# Altium schematic sheet ESP32 With USBC.SchDoc
size A2; SheetNumber: 1; SheetTotal: 1
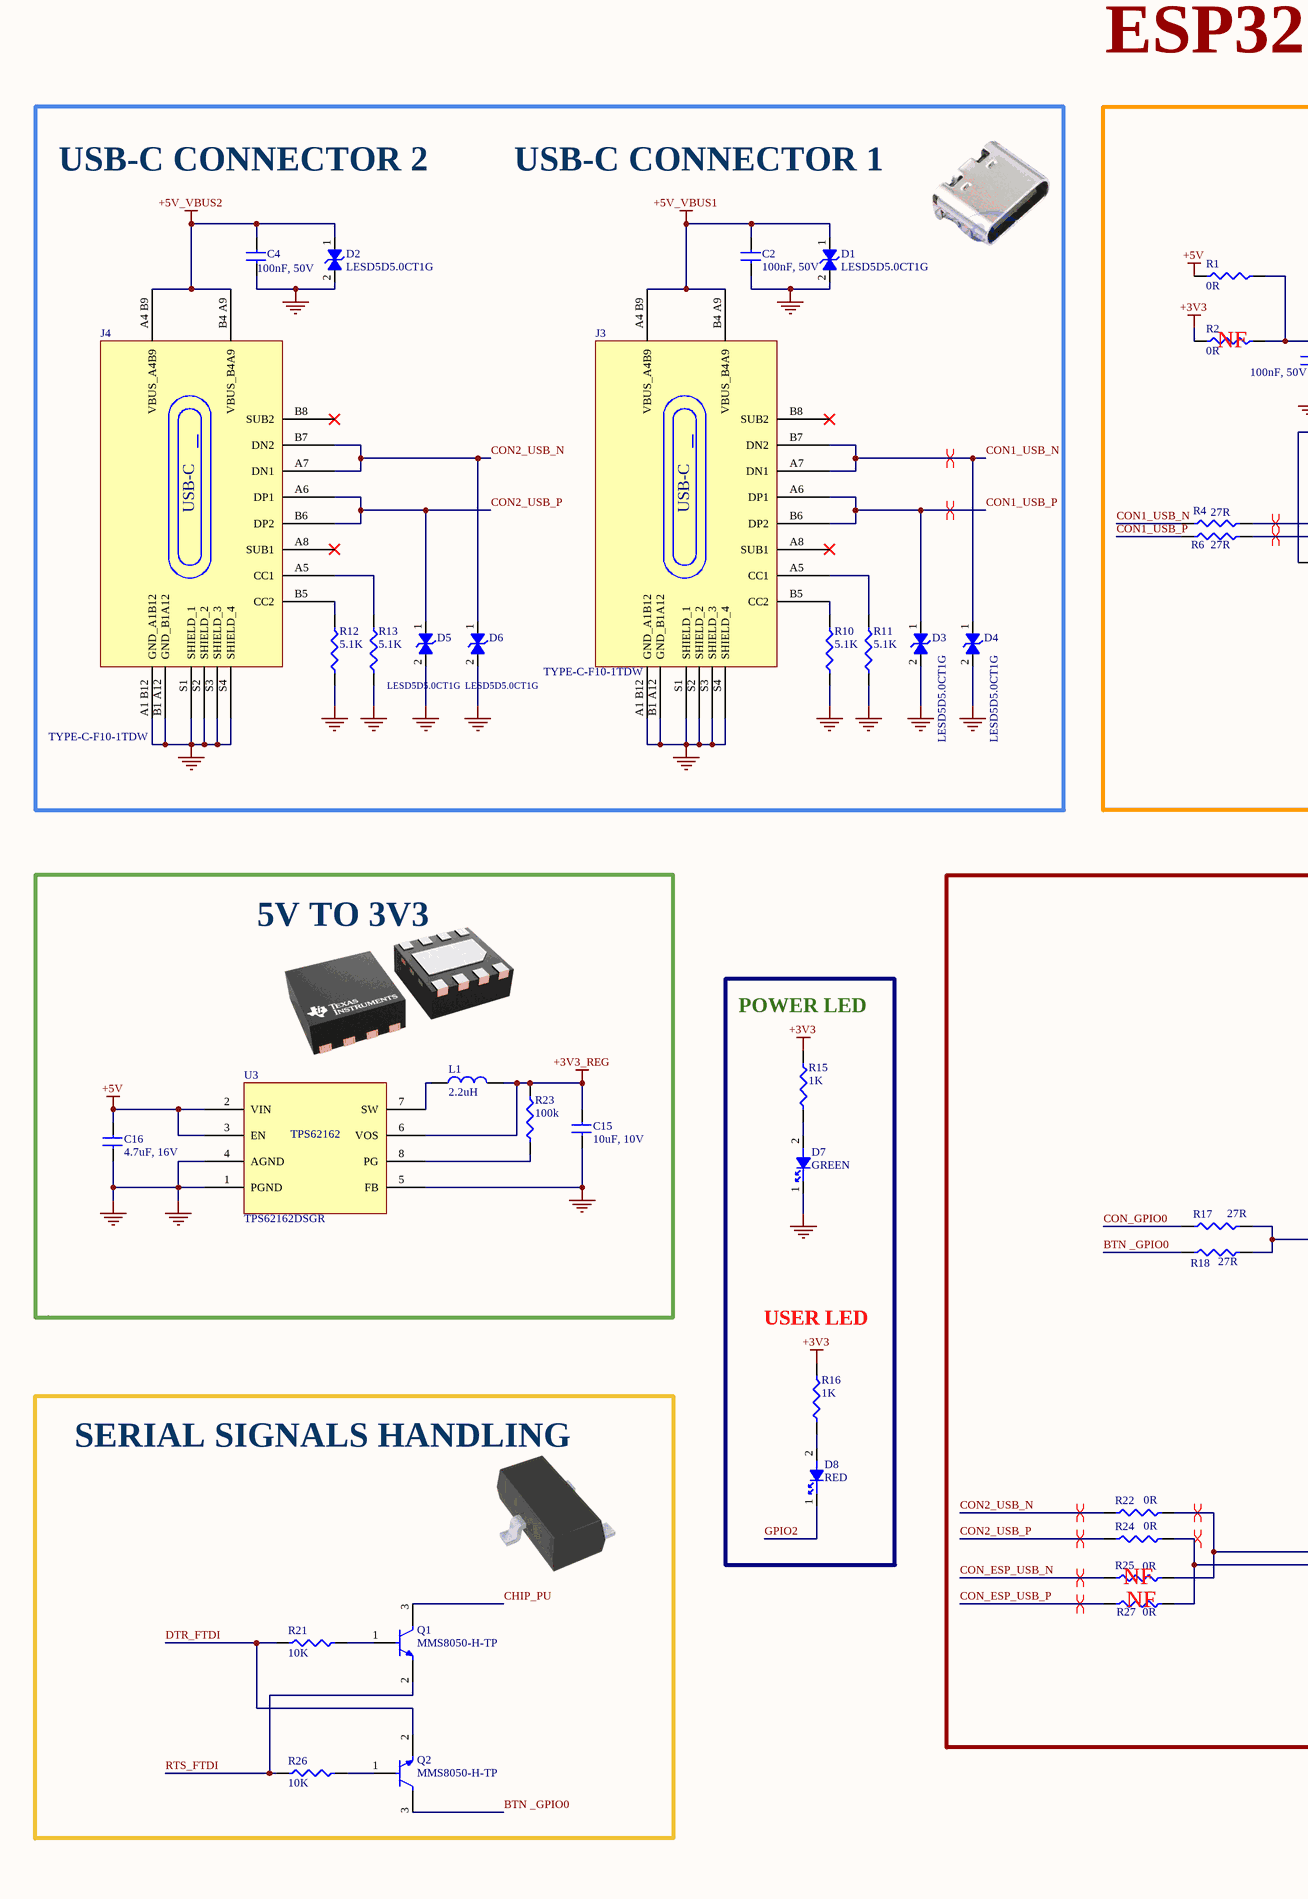
[diagram p0: ESP32 With USBC.SchDoc, left]
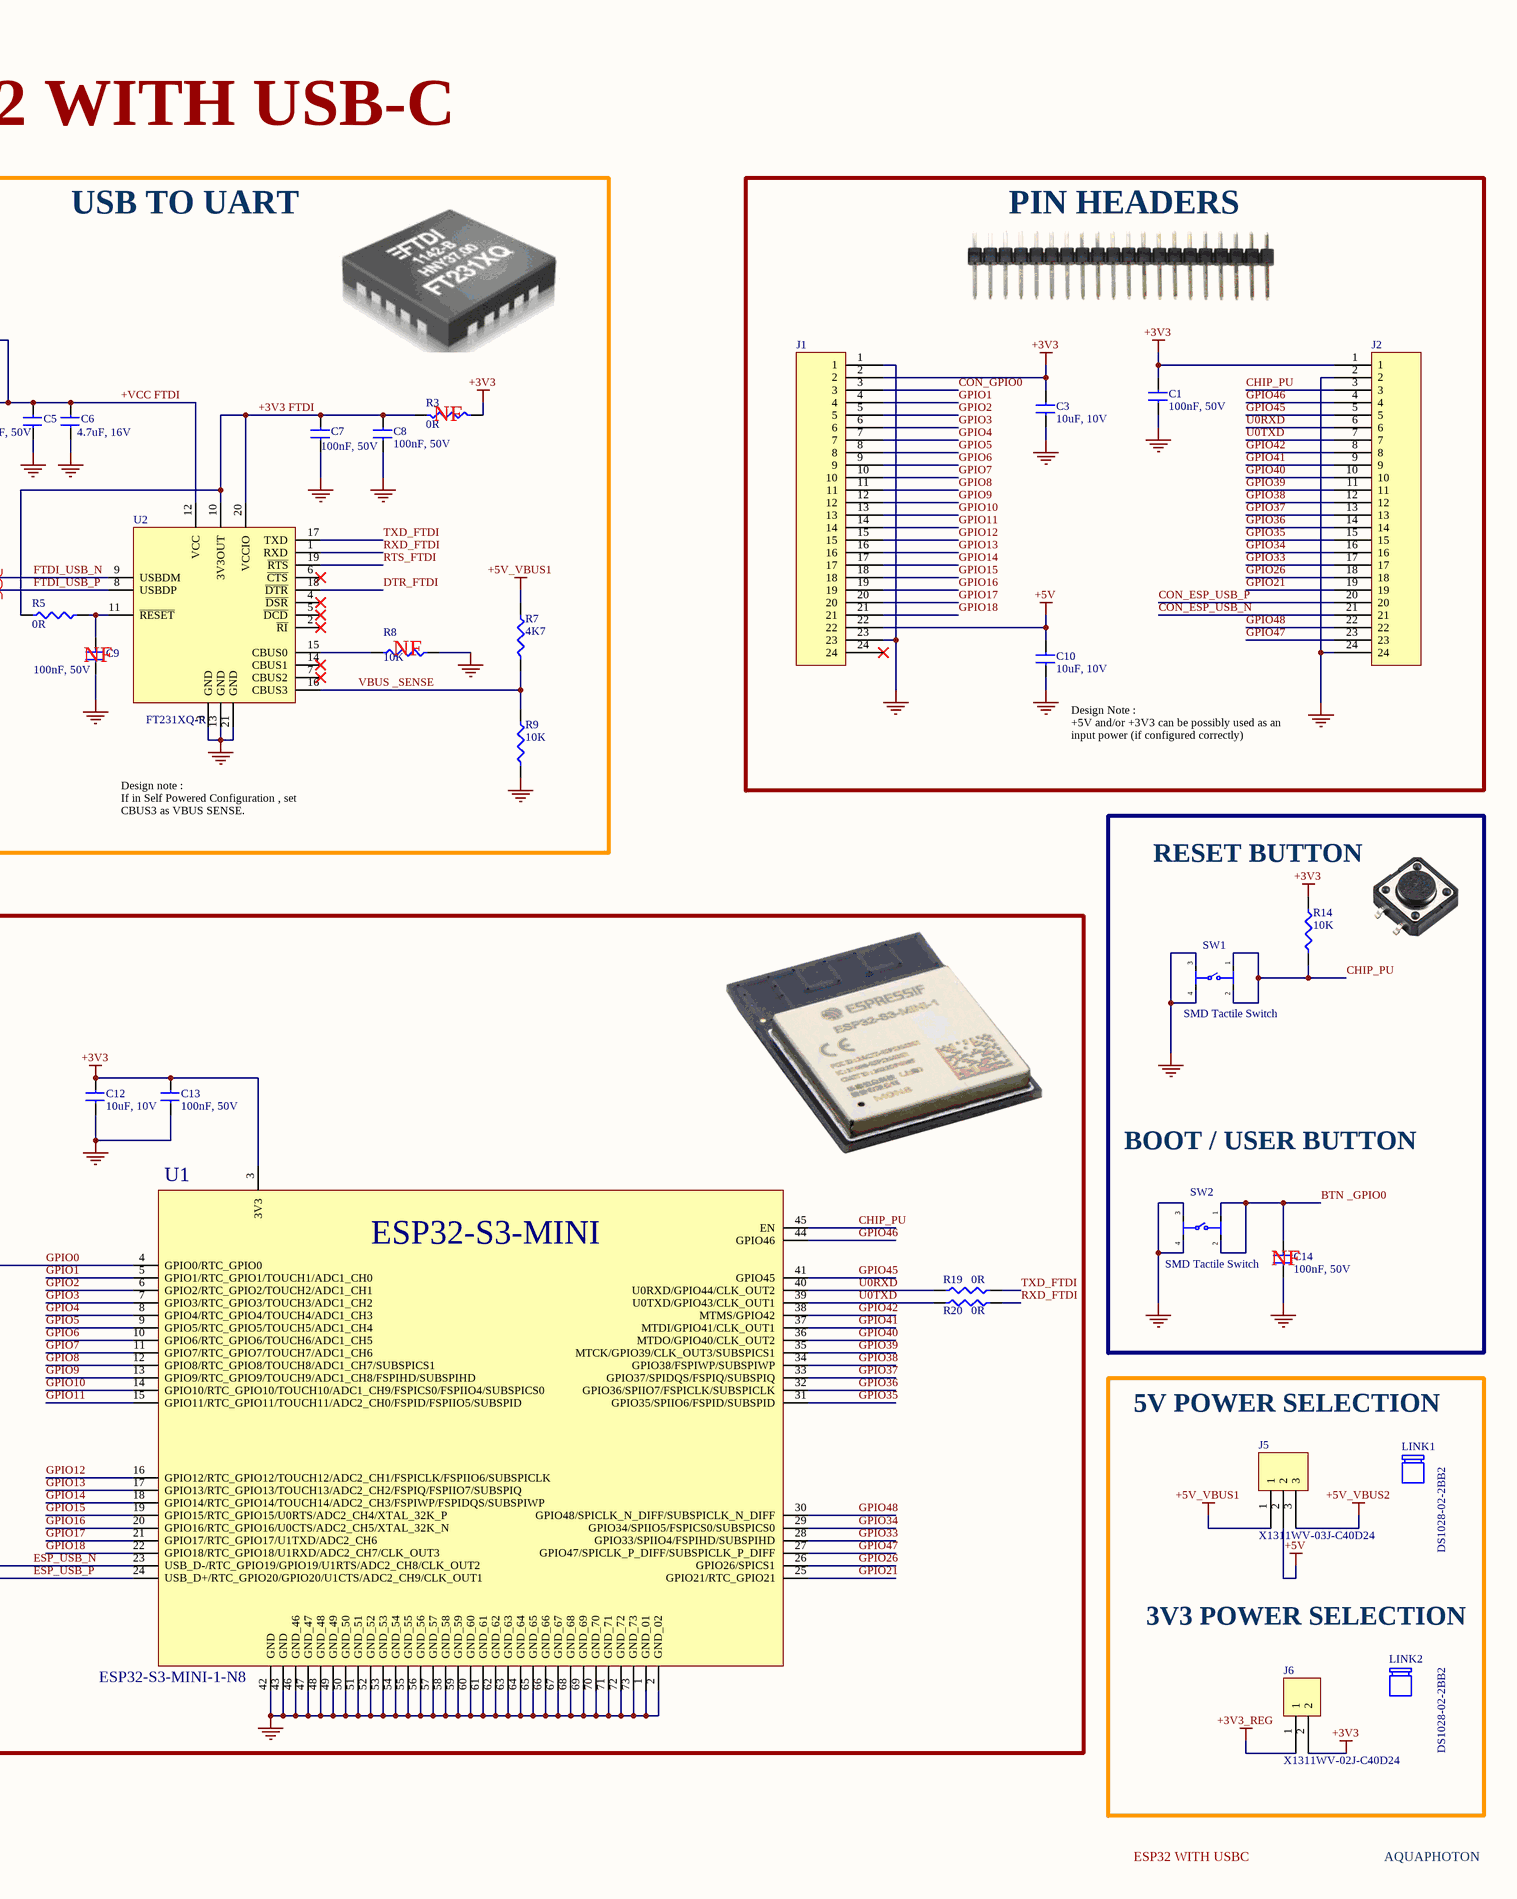
[diagram p1: ESP32 With USBC.SchDoc, right]

## Parts
C1  100nF, 50V  [CAP_SMD_0402_Samsung]
C2  100nF, 50V  [CAP_SMD_0402_Samsung]
C3  10uF, 10V  [CAP_SMD_0402_Samsung]
C4  100nF, 50V  [CAP_SMD_0402_Samsung]
C5  100nF, 50V  [CAP_SMD_0402_Samsung]
C6  4.7uF, 16V  [CAP_SMD_0402_Samsung]
C7  100nF, 50V  [CAP_SMD_0402_Samsung]
C8  100nF, 50V  [CAP_SMD_0402_Samsung]
C9  100nF, 50V  [CAP_SMD_0402_Samsung]
C10  10uF, 10V  [CAP_SMD_0402_Samsung]
C12  10uF, 10V  [CAP_SMD_0402_Samsung]
C13  100nF, 50V  [CAP_SMD_0402_Samsung]
C14  100nF, 50V  [CAP_SMD_0402_Samsung]
C15  10uF, 10V  [CAP_SMD_0402_Samsung]
C16  4.7uF, 16V  [CAP_SMD_0402_Samsung]
D1  LESD5D5.0CT1G  [TVS-Diode]
D2  LESD5D5.0CT1G  [TVS-Diode]
D3  LESD5D5.0CT1G  [TVS-Diode]
D4  LESD5D5.0CT1G  [TVS-Diode]
D5  LESD5D5.0CT1G  [TVS-Diode]
D6  LESD5D5.0CT1G  [TVS-Diode]
D7  GREEN  [LED_0402_G]
D8  RED  [LED_0402_R]
J1  X5511WV-24-C35D35-1000  [HDR_1X24_2.54MM]  (value not drawn)
J2  X5511WV-24-C35D35-1000  [HDR_1X24_2.54MM]  (value not drawn)
J3  TYPE-C-F10-1TDW  [USB-C]
J4  TYPE-C-F10-1TDW  [USB-C]
J5  X1311WV-03J-C40D24  [HDR_1X3_1.27mm - duplicate]
J6  X1311WV-02J-C40D24  [HDR_1X2_1.27mm]
L1  2.2uH  [Inductor_SMD_2.2uH]
LINK1  DS1028-02-2BB2  (mechanical)
LINK2  DS1028-02-2BB2  (mechanical)
Q1  MMS8050-H-TP  [SOT_Transistor]
Q2  MMS8050-H-TP  [SOT_Transistor]
R1  0R  [RES_SMD_0402]
R2  0R  [RES_SMD_0402]
R3  0R  [RES_SMD_0402]
R4  27R  [RES_SMD_0402]
R5  0R  [RES_SMD_0402]
R6  27R  [RES_SMD_0402]
R7  4K7  [RES_SMD_0402]
R8  10K  [RES_SMD_0402]
R9  10K  [RES_SMD_0402]
R10  5.1K  [RES_SMD_0402]
R11  5.1K  [RES_SMD_0402]
R12  5.1K  [RES_SMD_0402]
R13  5.1K  [RES_SMD_0402]
R14  10K  [RES_SMD_0402]
R15  1K  [RES_SMD_0402]
R16  1K  [RES_SMD_0402]
R17  27R  [RES_SMD_0402]
R18  27R  [RES_SMD_0402]
R19  0R  [RES_SMD_0402]
R20  0R  [RES_SMD_0402]
R21  10K  [RES_SMD_0402]
R22  0R  [RES_SMD_0402]
R23  100k  [RES_SMD_0402]
R24  0R  [RES_SMD_0402]
R25  0R  [RES_SMD_0402]
R26  10K  [RES_SMD_0402]
R27  0R  [RES_SMD_0402]
SW1  SMD Tactile Switch  [Tactile Switch_SMD]
SW2  SMD Tactile Switch  [Tactile Switch_SMD]
U1  ESP32-S3-MINI-1-N8  [ESP32-S3-MINI-1-N8]
U2  FT231XQ-R  [USB TO UART _FTDI]
U3  TPS62162DSGR  [BUCK_TPS62162DSGR]

## Nets
+3V3: C1.2 C3.2 C12.2 C13.2 J1.2 J2.1 J6.2 R2.1 R3.1 R14.2 R15.2 R16.2 U1.3(3V3)
+3V3_REG: C15.2 J6.1 L1.2 R23.2 U3.6(VOS)
+5V: C10.2 C16.2 J1.22 J5.2 R1.1 U3.2(VIN) U3.3(EN)
+5V_VBUS1: C2.2 D1.1 J3.A4_B9(VBUS_A4B9) J3.B4_A9(VBUS_B4A9) J5.1 R7.2
+5V_VBUS2: C4.2 D2.1 J4.A4_B9(VBUS_A4B9) J4.B4_A9(VBUS_B4A9) J5.3
GND: C1.1 C2.1 C3.1 C4.1 C5.1 C6.1 C7.1 C8.1 C9.1 C10.1 C12.1 C13.1 C14.1 C15.1 C16.1 D1.2 D2.2 D3.2 D4.2 D5.2 D6.2 D7.1 J1.1 J1.23 J2.2 J2.24 J3.A1_B12(GND_A1B12) J3.B1_A12(GND_B1A12) J3.S1(SHIELD_1) J3.S2(SHIELD_2) J3.S3(SHIELD_3) J3.S4(SHIELD_4) J4.A1_B12(GND_A1B12) J4.B1_A12(GND_B1A12) J4.S1(SHIELD_1) J4.S2(SHIELD_2) J4.S3(SHIELD_3) J4.S4(SHIELD_4) R8.2 R9.1 R10.1 R11.1 R12.1 R13.1 SW1.3 SW1.4 SW2.3 SW2.4 U1.1(GND_01) U1.2(GND_02) U1.42(GND) U1.43(GND) U1.46(GND_46) U1.47(GND_47) U1.48(GND_48) U1.49(GND_49) U1.50(GND_50) U1.51(GND_51) U1.52(GND_52) U1.53(GND_53) U1.54(GND_54) U1.55(GND_55) U1.56(GND_56) U1.57(GND_57) U1.58(GND_58) U1.59(GND_59) U1.60(GND_60) U1.61(GND_61) U1.62(GND_62) U1.63(GND_63) U1.64(GND_64) U1.65(GND_65) U1.66(GND_66) U1.67(GND_67) U1.68(GND_68) U1.69(GND_69) U1.70(GND_70) U1.71(GND_71) U1.72(GND_72) U1.73(GND_73) U2.3(GND) U2.13(GND) U2.21(GND) U3.1(PGND) U3.4(AGND) U3.5(FB)
+3V3 FTDI: C7.2 C8.2 R3.2 R5.1 U2.10(3V3OUT) U2.20(VCCIO)
+VCC FTDI: C5.2 C6.2 R1.2 R2.2 U2.12(VCC)
BTN _GPIO0: C14.2 Q2.3(C) R18.1 SW2.1 SW2.2
CHIP_PU: J2.3 Q1.3(C) R14.1 SW1.1 SW1.2 U1.45(EN)
CON1_USB_N: D4.1 J3.A7(DN1) J3.B7(DN2) R4.1
CON1_USB_P: D3.1 J3.A6(DP1) J3.B6(DP2) R6.1
CON2_USB_N: D6.1 J4.A7(DN1) J4.B7(DN2) R22.1
CON2_USB_P: D5.1 J4.A6(DP1) J4.B6(DP2) R24.1
CON_ESP_USB_N: J2.21 R25.1
CON_ESP_USB_P: J2.20 R27.1
CON_GPIO0: J1.3 R17.1
DTR_FTDI: Q2.2(E) R21.2 U2.18(~{DTR})
ESP_USB_N: R22.2 R25.2 U1.23(USB_D-/RTC_GPIO19/GPIO19/U1RTS/ADC2_CH8/CLK_OUT2)
ESP_USB_P: R24.2 R27.2 U1.24(USB_D+/RTC_GPIO20/GPIO20/U1CTS/ADC2_CH9/CLK_OUT1)
FTDI_USB_N: R4.2 U2.9(USBDM)
FTDI_USB_P: R6.2 U2.8(USBDP)
GPIO0: R17.2 R18.2 U1.4(GPIO0/RTC_GPIO0)
GPIO1: J1.4 U1.5(GPIO1/RTC_GPIO1/TOUCH1/ADC1_CH0)
GPIO2: D8.1 J1.5 U1.6(GPIO2/RTC_GPIO2/TOUCH2/ADC1_CH1)
GPIO3: J1.6 U1.7(GPIO3/RTC_GPIO3/TOUCH3/ADC1_CH2)
GPIO4: J1.7 U1.8(GPIO4/RTC_GPIO4/TOUCH4/ADC1_CH3)
GPIO5: J1.8 U1.9(GPIO5/RTC_GPIO5/TOUCH5/ADC1_CH4)
GPIO6: J1.9 U1.10(GPIO6/RTC_GPIO6/TOUCH6/ADC1_CH5)
GPIO7: J1.10 U1.11(GPIO7/RTC_GPIO7/TOUCH7/ADC1_CH6)
GPIO8: J1.11 U1.12(GPIO8/RTC_GPIO8/TOUCH8/ADC1_CH7/SUBSPICS1)
GPIO9: J1.12 U1.13(GPIO9/RTC_GPIO9/TOUCH9/ADC1_CH8/FSPIHD/SUBSPIHD)
GPIO10: J1.13 U1.14(GPIO10/RTC_GPIO10/TOUCH10/ADC1_CH9/FSPICS0/FSPIIO4/SUBSPICS0)
GPIO11: J1.14 U1.15(GPIO11/RTC_GPIO11/TOUCH11/ADC2_CH0/FSPID/FSPIIO5/SUBSPID)
GPIO12: J1.15 U1.16(GPIO12/RTC_GPIO12/TOUCH12/ADC2_CH1/FSPICLK/FSPIIO6/SUBSPICLK)
GPIO13: J1.16 U1.17(GPIO13/RTC_GPIO13/TOUCH13/ADC2_CH2/FSPIQ/FSPIIO7/SUBSPIQ)
GPIO14: J1.17 U1.18(GPIO14/RTC_GPIO14/TOUCH14/ADC2_CH3/FSPIWP/FSPIDQS/SUBSPIWP)
GPIO15: J1.18 U1.19(GPIO15/RTC_GPIO15/U0RTS/ADC2_CH4/XTAL_32K_P)
GPIO16: J1.19 U1.20(GPIO16/RTC_GPIO16/U0CTS/ADC2_CH5/XTAL_32K_N)
GPIO17: J1.20 U1.21(GPIO17/RTC_GPIO17/U1TXD/ADC2_CH6)
GPIO18: J1.21 U1.22(GPIO18/RTC_GPIO18/U1RXD/ADC2_CH7/CLK_OUT3)
GPIO21: J2.19 U1.25(GPIO21/RTC_GPIO21)
GPIO26: J2.18 U1.26(GPIO26/SPICS1)
GPIO33: J2.17 U1.28(GPIO33/SPIIO4/FSPIHD/SUBSPIHD)
GPIO34: J2.16 U1.29(GPIO34/SPIIO5/FSPICS0/SUBSPICS0)
GPIO35: J2.15 U1.31(GPIO35/SPIIO6/FSPID/SUBSPID)
GPIO36: J2.14 U1.32(GPIO36/SPIIO7/FSPICLK/SUBSPICLK)
GPIO37: J2.13 U1.33(GPIO37/SPIDQS/FSPIQ/SUBSPIQ)
GPIO38: J2.12 U1.34(GPIO38/FSPIWP/SUBSPIWP)
GPIO39: J2.11 U1.35(MTCK/GPIO39/CLK_OUT3/SUBSPICS1)
GPIO40: J2.10 U1.36(MTDO/GPIO40/CLK_OUT2)
GPIO41: J2.9 U1.37(MTDI/GPIO41/CLK_OUT1)
GPIO42: J2.8 U1.38(MTMS/GPIO42)
GPIO45: J2.5 U1.41(GPIO45)
GPIO46: J2.4 U1.44(GPIO46)
GPIO47: J2.23 U1.27(GPIO47/SPICLK_P_DIFF/SUBSPICLK_P_DIFF)
GPIO48: J2.22 U1.30(GPIO48/SPICLK_N_DIFF/SUBSPICLK_N_DIFF)
RTS_FTDI: Q1.2(E) R26.2 U2.19(~{RTS})
RXD_FTDI: R20.2 U2.1(RXD)
TXD_FTDI: R19.2 U2.17(TXD)
U0RXD: J2.6 R19.1 U1.40(U0RXD/GPIO44/CLK_OUT2)
U0TXD: J2.7 R20.1 U1.39(U0TXD/GPIO43/CLK_OUT1)
VBUS _SENSE: R7.1 R9.2 U2.16(CBUS3)
NetC9_2: C9.2 R5.2 U2.11(~{RESET})
NetD7_2: D7.2 R15.1
NetD8_2: D8.2 R16.1
NetJ3_A5: J3.A5(CC1) R11.2
NetJ3_B5: J3.B5(CC2) R10.2
NetJ4_A5: J4.A5(CC1) R13.2
NetJ4_B5: J4.B5(CC2) R12.2
NetL1_1: L1.1 U3.7(SW)
NetQ1_1: Q1.1(B) R21.1
NetQ2_1: Q2.1(B) R26.1
NetR8_1: R8.1 U2.15(CBUS0)
NetR23_1: R23.1 U3.8(PG)

Not connected (* = marked no-connect by the designer): J1 24*; J3 A8(SUB1)* B8(SUB2)*; J4 A8(SUB1)* B8(SUB2)*; U2 2(~{RI})* 4(~{DSR})* 5(~{DCD})* 6(~{CTS})* 7(CBUS2)* 14(CBUS1)*

## Layout directives
differential pair; differential pair class DIFF90: CON1_USB_N, CON1_USB_P, CON2_USB_N, CON2_USB_P, CON_ESP_USB_N, CON_ESP_USB_P, ESP_USB_N, ESP_USB_P, FTDI_USB_N, FTDI_USB_P

## Notes on the sheet
- ESP32 WITH USB-C
- USB-C CONNECTOR 2
- USB-C CONNECTOR 1
- USB TO UART
- PIN HEADERS
- (near R2) NF
- (near R3) NF
- (near C9) NF
- (near R8) NF
- (near C10) Design Note :
  +5V and/or +3V3 can be possibly used as an input power (if configured correctly)
- Design note :
  If in Self Powered Configuration , set CBUS3 as VBUS SENSE.
- (near R14) RESET BUTTON
- 5V TO 3V3
- (near R15) POWER LED
- BOOT / USER BUTTON
- (near C14) NF
- (near R16) USER LED
- (near LINK1) 5V POWER SELECTION
- SERIAL SIGNALS HANDLING
- (near R25) NF
- (near R27) NF
- (near LINK2) 3V3 POWER SELECTION
- ESP32 WITH USBC
- AQUAPHOTON
- (in symbol ESP32-S3-MINI-1-N8) ESP32-S3-MINI
- (in symbol TPS62162DSGR) TPS62162
- (in symbol TYPE-C-F10-1TDW) USB-C

## Library data of the parts
C1 C2 C4 C5 C7-C9 C13 C14 = CL05B104KB54PNC: CAP CER 0.1UF 50V X7R 0402; Manufacturer: Samsung; Supplier: LCSC; Supplier Part Number: C307331; Manufacturer Part Number: CL05B104KB54PNC; ComponentLink1URL: https://datasheet.ciiva.com:443/pdfs/VipMasterIC/IC/SEMS/SEMS-S-A0006318249/SEMS-S-A0006320959-1.pdf?src-supplier=IHS+Markit; ComponentLink1Description: https://datasheet.ciiva.com:443/pdfs/VipMasterIC/IC/SEMS/SEMS-S-A0006318249/SEMS-S-A0006320959-1.pdf?src-supplier=IHS+Markit; ComponentLink2URL: https://datasheet.octopart.com/CL05B104KB54PNC-Samsung-datasheet-8326407.pdf?src-supplier=TME; ComponentLink2Description: https://datasheet.octopart.com/CL05B104KB54PNC-Samsung-datasheet-8326407.pdf?src-supplier=TME
C3 C10 C12 C15 = CL05A106MP8NUB8: CAP CER 10UF 10V X5R 0402; Manufacturer: Samsung; Supplier: LCSC; Supplier Part Number: C307415; Manufacturer Part Number: CL05A106MP8NUB8; ComponentLink1URL: https://datasheet.ciiva.com:443/pdfs/VipMasterIC/IC/SEMS/SEMS-S-A0008521219/SEMS-S-A0008521325-1.pdf?src-supplier=IHS+Markit; ComponentLink1Description: https://datasheet.ciiva.com:443/pdfs/VipMasterIC/IC/SEMS/SEMS-S-A0008521219/SEMS-S-A0008521325-1.pdf?src-supplier=IHS+Markit; ComponentLink2URL: http://www.samsungsem.com/kr/support/product-search/mlcc/CL05A106MP8NUB8.jsp?src-supplier=Digikey; ComponentLink2Description: http://www.samsungsem.com/kr/support/product-search/mlcc/CL05A106MP8NUB8.jsp?src-supplier=Digikey; ComponentLink3URL: https://datasheet.octopart.com/CL05A106MP8NUB8-Samsung-Electro-Mechanics-datasheet-136460857.pdf?src-supplier=Future+Electronics; ComponentLink3Description: https://datasheet.octopart.com/CL05A106MP8NUB8-Samsung-Electro-Mechanics-datasheet-136460857.pdf?src-supplier=Future+Electronics
C6 C16 = CL05A475MO5NUNC: 4.7 µF ±20% 16V Ceramic Capacitor X5R 0402 (1005 Metric); Manufacturer: Samsung; Supplier: LCSC; Supplier Part Number: C318563; Manufacturer Part Number: CL05A475MO5NUNC; ComponentLink1URL: https://datasheet.ciiva.com:443/pdfs/VipMasterIC/IC/SEMS/SEMS-S-A0008384515/SEMS-S-A0008898881-1.pdf?src-supplier=IHS+Markit; ComponentLink1Description: https://datasheet.ciiva.com:443/pdfs/VipMasterIC/IC/SEMS/SEMS-S-A0008384515/SEMS-S-A0008898881-1.pdf?src-supplier=IHS+Markit; ComponentLink2URL: http://www.farnell.com/datasheets/2710653.pdf?src-supplier=Farnell; ComponentLink2Description: http://www.farnell.com/datasheets/2710653.pdf?src-supplier=Farnell; ComponentLink3URL: http://www.samsungsem.com/kr/support/product-search/mlcc/CL05A475MO5NUNC.jsp?src-supplier=Digikey; ComponentLink3Description: http://www.samsungsem.com/kr/support/product-search/mlcc/CL05A475MO5NUNC.jsp?src-supplier=Digikey; ComponentLink4URL: http://www.farnell.com/datasheets/2710653.pdf?src-supplier=Newark; ComponentLink4Description: http://www.farnell.com/datasheets/2710653.pdf?src-supplier=Newark; ComponentLink5URL: http://www.farnell.com/datasheets/2710653.pdf?src-supplier=Element14; ComponentLink5Description: http://www.farnell.com/datasheets/2710653.pdf?src-supplier=Element14; ComponentLink6URL: https://datasheet.octopart.com/CL05A475MO5NUNC-Samsung-Electro-Mechanics-datasheet-123102911.pdf?src-supplier=Future+Electronics; ComponentLink6Description: https://datasheet.octopart.com/CL05A475MO5NUNC-Samsung-Electro-Mechanics-datasheet-123102911.pdf?src-supplier=Future+Electronics
D1-D6 = LESD5D5.0CT1G: 9.4A 18.6V 5.6V Bidirectional 5V SOD-523 ESD and Surge Protection (TVS/ESD) ROHS; Manufacturer: LRC; Manufacturer Part Number: LESD5D5.0CT1G; Supplier: LCSC; Supplier Part Number: C383211
D7 = VLMG1500-GS08: LED GREEN 0402 SMD; Manufacturer: Vishay; Supplier: LCSC; Supplier Part Number: C511404; Manufacturer Part Number: VLMG1500-GS08; ComponentLink1URL: https://datasheet.ciiva.com:443/pdfs/VipMasterIC/IC/VISH/VISH-S-A0003457490/VISH-S-A0003457490-1.pdf?src-supplier=IHS+Markit; ComponentLink1Description: https://datasheet.ciiva.com:443/pdfs/VipMasterIC/IC/VISH/VISH-S-A0003457490/VISH-S-A0003457490-1.pdf?src-supplier=IHS+Markit; ComponentLink2URL: https://datasheet.ciiva.com/12071/vlmo1500-244705-12071911.pdf?src-supplier=Mouser; ComponentLink2Description: https://datasheet.ciiva.com/12071/vlmo1500-244705-12071911.pdf?src-supplier=Mouser; ComponentLink3URL: https://datasheet.ciiva.com/30005/vlmo1500-30005134.pdf?src-supplier=Avnet; ComponentLink3Description: https://datasheet.ciiva.com/30005/vlmo1500-30005134.pdf?src-supplier=Avnet
D8 = VLMS1500-GS08: LED RED 0402 SMD; Manufacturer: Vishay; Supplier: LCSC; Supplier Part Number: C511370; Manufacturer Part Number: VLMS1500-GS08; ComponentLink1URL: https://datasheet.ciiva.com:443/pdfs/VipMasterIC/IC/VISH/VISH-S-A0003457490/VISH-S-A0003457490-1.pdf?src-supplier=IHS+Markit; ComponentLink1Description: https://datasheet.ciiva.com:443/pdfs/VipMasterIC/IC/VISH/VISH-S-A0003457490/VISH-S-A0003457490-1.pdf?src-supplier=IHS+Markit; ComponentLink2URL: http://www.farnell.com/datasheets/1809983.pdf?src-supplier=Farnell; ComponentLink2Description: http://www.farnell.com/datasheets/1809983.pdf?src-supplier=Farnell; ComponentLink3URL: http://www.mouser.com/ds/2/427/vlmo1500-244705.pdf?src-supplier=Mouser; ComponentLink3Description: http://www.mouser.com/ds/2/427/vlmo1500-244705.pdf?src-supplier=Mouser; ComponentLink4URL: http://www.alliedelec.com/m/d/cfc385e1097fc985ee9a50a3551ac188.pdf?src-supplier=Allied+Electronics; ComponentLink4Description: http://www.alliedelec.com/m/d/cfc385e1097fc985ee9a50a3551ac188.pdf?src-supplier=Allied+Electronics; ComponentLink5URL: https://datasheet.octopart.com/VLMS1500-GS08-Vishay-datasheet-62332426.pdf?src-supplier=Newark; ComponentLink5Description: https://datasheet.octopart.com/VLMS1500-GS08-Vishay-datasheet-62332426.pdf?src-supplier=Newark; ComponentLink6URL: https://datasheet.octopart.com/VLMS1500-GS08-Vishay-datasheet-33014519.pdf?src-supplier=Element14; ComponentLink6Description: https://datasheet.octopart.com/VLMS1500-GS08-Vishay-datasheet-33014519.pdf?src-supplier=Element14; ComponentLink7URL: http://datasheet.octopart.com/VLMS1500-GS08-Vishay-datasheet-21227148.pdf?src-supplier=Avnet; ComponentLink7Description: http://datasheet.octopart.com/VLMS1500-GS08-Vishay-datasheet-21227148.pdf?src-supplier=Avnet; ComponentLink8URL: http://www.farnell.com/datasheets/1809983.pdf?src-supplier=Newark; ComponentLink8Description: http://www.farnell.com/datasheets/1809983.pdf?src-supplier=Newark; ComponentLink9URL: http://www.farnell.com/datasheets/2050839.pdf?src-supplier=Newark; ComponentLink9Description: http://www.farnell.com/datasheets/2050839.pdf?src-supplier=Newark; ComponentLink10URL: https://datasheet.octopart.com/VLMS1500-GS08-Vishay-datasheet-21227148.pdf?src-supplier=Future+Electronics; ComponentLink10Description: https://datasheet.octopart.com/VLMS1500-GS08-Vishay-datasheet-21227148.pdf?src-supplier=Future+Electronics; ComponentLink11URL: http://datasheet.octopart.com/VLMS1500-GS08-Vishay-datasheet-21227148.pdf?src-supplier=Quest; ComponentLink11Description: http://datasheet.octopart.com/VLMS1500-GS08-Vishay-datasheet-21227148.pdf?src-supplier=Quest; ComponentLink12URL: http://datasheet.octopart.com/VLMS1500-GS08-Vishay-datasheet-21227148.pdf?src-supplier=NAC+Semi; ComponentLink12Description: http://datasheet.octopart.com/VLMS1500-GS08-Vishay-datasheet-21227148.pdf?src-supplier=NAC+Semi; ComponentLink13URL: http://datasheet.octopart.com/VLMS1500-GS08-Vishay-datasheet-21227148.pdf?src-supplier=LCSC; ComponentLink13Description: http://datasheet.octopart.com/VLMS1500-GS08-Vishay-datasheet-21227148.pdf?src-supplier=LCSC
J1 J2 = X6511WV-24H-C60D30: Gold 250V 3A Policy 2.5mm 24P 260℃ -40℃~+105℃ 2.54mm Brass Black Single Row 2.54mm 1x24P SMD,P=2.54mm Pin Headers ROHS; Manufacturer: XKB Connection; Supplier: LCSC; Supplier Part Number: C2883449; Manufacturer Part Number: X5511WV-24-C35D35-1000
J3 J4 = TYPE-C-F10-1TDW: 16P Type-C SMD USB Connectors; Manufacturer: XYECONN; Supplier: LCSC; Supplier Part Number: C20883031; Manufacturer Part Number: TYPE-C-F10-1TDW
J5 = X1311WV-03J-C40D24: Gold 250V 3A Policy 1mm 3P 260℃ -40℃~+105℃ 1.27mm Brass Black Single Row 1.27mm 1x3P Plugin,P=1.27mm Pin Headers ROHS; Manufacturer: XKB Connection; Supplier: LCSC; Supplier Part Number: C5243683; Manufacturer Part Number: X1311WV-03J-C40D24
J6 = X1311WV-02J-C40D24: Gold 250V 3A Policy 1mm 2P 260℃ -40℃~+105℃ 1.27mm Brass Black Single Row 1x2P 1.27mm Plugin,P=1.27mm Pin Headers ROHS; Manufacturer: XKB Connection; Supplier: LCSC; Supplier Part Number: C5243682; Manufacturer Part Number: X1311WV-02J-C40D24
L1 = MLP2012H2R2MT0S1: 2.2 µH Shielded Multilayer Inductor 1 A 195mOhm Max 0805 (2012 Metric); Manufacturer: TDK; Supplier: LCSC; Supplier Part Number: C383369; Manufacturer Part Number: MLP2012H2R2MT0S1; ComponentLink1URL: https://datasheet.ciiva.com:443/pdfs/VipMasterIC/IC/TDKC/TDKC-S-A0006854088/TDKC-S-A0006854088-1.pdf?src-supplier=IHS+Markit; ComponentLink1Description: https://datasheet.ciiva.com:443/pdfs/VipMasterIC/IC/TDKC/TDKC-S-A0006854088/TDKC-S-A0006854088-1.pdf?src-supplier=IHS+Markit; ComponentLink2URL: https://datasheet.ciiva.com/29697/inductor-commercial-power-mlp-en-29697706.pdf?src-supplier=Digikey; ComponentLink2Description: https://datasheet.ciiva.com/29697/inductor-commercial-power-mlp-en-29697706.pdf?src-supplier=Digikey; ComponentLink3URL: https://datasheet.ciiva.com/29697/inductor-commercial-power-mlp-en-29697707.pdf?src-supplier=Digikey; ComponentLink3Description: https://datasheet.ciiva.com/29697/inductor-commercial-power-mlp-en-29697707.pdf?src-supplier=Digikey; ComponentLink4URL: https://datasheet.ciiva.com/29697/inductor-commercial-power-mlp-en-29697708.pdf?src-supplier=Digikey; ComponentLink4Description: https://datasheet.ciiva.com/29697/inductor-commercial-power-mlp-en-29697708.pdf?src-supplier=Digikey
LINK1 LINK2 = DS1028-02-2BB2: CONN SHUNT  1.27mm; Manufacturer: CONNFLY Elec; Supplier: LCSC; Supplier Part Number: C86587; Manufacturer Part Number: DS1028-02-2BB2
Q1 Q2 = MMS8050-H-TP: Bipolar (BJT) Transistor NPN 25 V 500 mA 150MHz 300 mW Surface Mount SOT-23; Manufacturer: MCC; Supplier: LCSC; Supplier Part Number: C668971; Manufacturer Part Number: MMS8050-H-TP; ComponentLink1URL: https://datasheet.ciiva.com:443/pdfs/VipMasterIC/IC/MCCC/MCCC-S-A0005071305/MCCC-S-A0005071739-1.pdf?src-supplier=IHS+Markit; ComponentLink1Description: https://datasheet.ciiva.com:443/pdfs/VipMasterIC/IC/MCCC/MCCC-S-A0005071305/MCCC-S-A0005071739-1.pdf?src-supplier=IHS+Markit; ComponentLink2URL: http://components.arrow.com/part/dataview/56206496S302966N2022?src-supplier=Arrow+Electronics; ComponentLink2Description: http://components.arrow.com/part/dataview/56206496S302966N2022?src-supplier=Arrow+Electronics; ComponentLink3URL: http://www.mccsemi.com/up_pdf/MMS8050(SOT-23).pdf?src-supplier=Digikey; ComponentLink3Description: http://www.mccsemi.com/up_pdf/MMS8050(SOT-23).pdf?src-supplier=Digikey
R1-R3 R5 R19 R20 R22 R24 R25 R27 = RC0402JR-070RL: 0 Ohms Jumper Chip Resistor 0402 (1005 Metric) Moisture Resistant Thick Film; Manufacturer: Yageo; Supplier: LCSC; Supplier Part Number: C60485; Manufacturer Part Number: RC0402JR-070RL; ComponentLink1URL: https://datasheet.ciiva.com:443/pdfs/VipMasterIC/IC/YAGO/YAGO-S-A0008145938/YAGO-S-A0008145938-1.pdf?src-supplier=IHS+Markit; ComponentLink1Description: https://datasheet.ciiva.com:443/pdfs/VipMasterIC/IC/YAGO/YAGO-S-A0008145938/YAGO-S-A0008145938-1.pdf?src-supplier=IHS+Markit
R4 R6 R17 R18 = RC0402FR-0727RL: 27 Ohms ±1% 0.063W, 1/16W Chip Resistor 0402 (1005 Metric) Moisture Resistant Thick Film; Manufacturer: Yageo; Supplier: LCSC; Supplier Part Number: C138021; Manufacturer Part Number: RC0402FR-0727RL; ComponentLink1URL: https://datasheet.ciiva.com:443/pdfs/VipMasterIC/IC/YAGO/YAGO-S-A0008145938/YAGO-S-A0008145938-1.pdf?src-supplier=IHS+Markit; ComponentLink1Description: https://datasheet.ciiva.com:443/pdfs/VipMasterIC/IC/YAGO/YAGO-S-A0008145938/YAGO-S-A0008145938-1.pdf?src-supplier=IHS+Markit; ComponentLink2URL: https://datasheet.ciiva.com/11808/0900766b80c66297-11808450.pdf?src-supplier=Rs; ComponentLink2Description: https://datasheet.ciiva.com/11808/0900766b80c66297-11808450.pdf?src-supplier=Rs; ComponentLink3URL: https://datasheet.ciiva.com/7849/1018594-7849927.pdf?src-supplier=Element14; ComponentLink3Description: https://datasheet.ciiva.com/7849/1018594-7849927.pdf?src-supplier=Element14; ComponentLink4URL: https://datasheet.ciiva.com/7849/1018594-7849926.pdf?src-supplier=Element14; ComponentLink4Description: https://datasheet.ciiva.com/7849/1018594-7849926.pdf?src-supplier=Element14; ComponentLink5URL: https://datasheet.ciiva.com/17044/pyu-rc0402-51-rohs-l-6-17044345.pdf?src-supplier=Future+Electronics; ComponentLink5Description: https://datasheet.ciiva.com/17044/pyu-rc0402-51-rohs-l-6-17044345.pdf?src-supplier=Future+Electronics; ComponentLink6URL: https://datasheet.ciiva.com/15189/getdatasheetpartid-327852-15189402.pdf?src-supplier=Verical; ComponentLink6Description: https://datasheet.ciiva.com/15189/getdatasheetpartid-327852-15189402.pdf?src-supplier=Verical
R7 = RC0402FR-074K7L: 4.7 kOhms ±1% 0.063W, 1/16W Chip Resistor 0402 (1005 Metric) Moisture Resistant Thick Film; Manufacturer: Yageo; Supplier: LCSC; Supplier Part Number: C105871; Manufacturer Part Number: RC0402FR-074K7L; ComponentLink1URL: https://datasheet.ciiva.com:443/pdfs/VipMasterIC/IC/YAGO/YAGO-S-A0008145938/YAGO-S-A0008145938-1.pdf?src-supplier=IHS+Markit; ComponentLink1Description: https://datasheet.ciiva.com:443/pdfs/VipMasterIC/IC/YAGO/YAGO-S-A0008145938/YAGO-S-A0008145938-1.pdf?src-supplier=IHS+Markit; ComponentLink2URL: https://datasheet.ciiva.com/22661/1686128-22661342.pdf?src-supplier=Element14; ComponentLink2Description: https://datasheet.ciiva.com/22661/1686128-22661342.pdf?src-supplier=Element14; ComponentLink3URL: https://datasheet.ciiva.com/7850/1018594-7850022.pdf?src-supplier=Element14; ComponentLink3Description: https://datasheet.ciiva.com/7850/1018594-7850022.pdf?src-supplier=Element14; ComponentLink4URL: https://datasheet.ciiva.com/7850/1018594-7850023.pdf?src-supplier=Element14; ComponentLink4Description: https://datasheet.ciiva.com/7850/1018594-7850023.pdf?src-supplier=Element14; ComponentLink5URL: https://datasheet.ciiva.com/15215/getdatasheetpartid-328119-15215035.pdf?src-supplier=Verical; ComponentLink5Description: https://datasheet.ciiva.com/15215/getdatasheetpartid-328119-15215035.pdf?src-supplier=Verical
R8 R9 R14 R21 R26 = AC0402FR-0710KL: 62.5mW Thick Film Resistors 50V ±100ppm/℃ ±1% 10kΩ 0402 Chip Resistor - Surface Mount ROHS; Manufacturer: Yageo; Supplier: LCSC; Supplier Part Number: YAG3436CT-ND; Manufacturer Part Number: AC0402FR-0710KL; ComponentLink1URL: https://datasheet.ciiva.com:443/pdfs/VipMasterIC/IC/YAGO/YAGO-S-A0003597364/YAGO-S-A0003597364-1.pdf?src-supplier=IHS+Markit; ComponentLink1Description: https://datasheet.ciiva.com:443/pdfs/VipMasterIC/IC/YAGO/YAGO-S-A0003597364/YAGO-S-A0003597364-1.pdf?src-supplier=IHS+Markit; ComponentLink2URL: https://datasheet.ciiva.com/12656/pyu-ac-51-rohs-l-2-12656634.pdf?src-supplier=Mouser; ComponentLink2Description: https://datasheet.ciiva.com/12656/pyu-ac-51-rohs-l-2-12656634.pdf?src-supplier=Mouser
R10-R13 = AC0402FR-075K1L: 5.1 kOhms ±1% 0.063W, 1/16W Chip Resistor 0402 (1005 Metric) Automotive AEC-Q200, Moisture Resistant Thick Film; Manufacturer: Yageo; Supplier: LCSC; Supplier Part Number: C144745; Manufacturer Part Number: AC0402FR-075K1L; ComponentLink1URL: https://datasheet.ciiva.com:443/pdfs/VipMasterIC/IC/YAGO/YAGO-S-A0003597364/YAGO-S-A0003597364-1.pdf?src-supplier=IHS+Markit; ComponentLink1Description: https://datasheet.ciiva.com:443/pdfs/VipMasterIC/IC/YAGO/YAGO-S-A0003597364/YAGO-S-A0003597364-1.pdf?src-supplier=IHS+Markit; ComponentLink2URL: https://datasheet.octopart.com/AC0402FR-075K1L-Yageo-datasheet-166720450.pdf?src-supplier=Future+Electronics; ComponentLink2Description: https://datasheet.octopart.com/AC0402FR-075K1L-Yageo-datasheet-166720450.pdf?src-supplier=Future+Electronics; ComponentLink3URL: http://www.yageo.com/documents/recent/PYu-AC_51_RoHS_L_2_revised.pdf?src-supplier=Future+Electronics; ComponentLink3Description: http://www.yageo.com/documents/recent/PYu-AC_51_RoHS_L_2_revised.pdf?src-supplier=Future+Electronics
R15 R16 = RC0402FR-071KL: RES 1K OHM 1% 1/16W 0402; Manufacturer: Yageo; Supplier: LCSC; Supplier Part Number: C106235; Manufacturer Part Number: RC0402FR-071KL; ComponentLink1URL: https://datasheet.ciiva.com:443/pdfs/VipMasterIC/IC/YAGO/YAGO-S-A0008145938/YAGO-S-A0008145938-1.pdf?src-supplier=IHS+Markit; ComponentLink1Description: https://datasheet.ciiva.com:443/pdfs/VipMasterIC/IC/YAGO/YAGO-S-A0008145938/YAGO-S-A0008145938-1.pdf?src-supplier=IHS+Markit; ComponentLink2URL: https://datasheet.ciiva.com/11819/0900766b80c66297-11819477.pdf?src-supplier=Rs; ComponentLink2Description: https://datasheet.ciiva.com/11819/0900766b80c66297-11819477.pdf?src-supplier=Rs; ComponentLink3URL: https://datasheet.ciiva.com/22747/1018594-22747513.pdf?src-supplier=Element14; ComponentLink3Description: https://datasheet.ciiva.com/22747/1018594-22747513.pdf?src-supplier=Element14; ComponentLink4URL: https://datasheet.ciiva.com/12666/pyu-rc0402-51-rohs-l-6-r-12666741.pdf?src-supplier=Mouser; ComponentLink4Description: https://datasheet.ciiva.com/12666/pyu-rc0402-51-rohs-l-6-r-12666741.pdf?src-supplier=Mouser; ComponentLink5URL: https://datasheet.ciiva.com/17063/pyu-rc0402-51-rohs-l-6-r-17063193.pdf?src-supplier=Future+Electronics; ComponentLink5Description: https://datasheet.ciiva.com/17063/pyu-rc0402-51-rohs-l-6-r-17063193.pdf?src-supplier=Future+Electronics; ComponentLink6URL: https://datasheet.ciiva.com/7983/1018594-7983502.pdf?src-supplier=Element14; ComponentLink6Description: https://datasheet.ciiva.com/7983/1018594-7983502.pdf?src-supplier=Element14; ComponentLink7URL: https://datasheet.ciiva.com/7849/1018594-7849869.pdf?src-supplier=Element14; ComponentLink7Description: https://datasheet.ciiva.com/7849/1018594-7849869.pdf?src-supplier=Element14; ComponentLink8URL: https://datasheet.ciiva.com/7849/1018594-7849871.pdf?src-supplier=Element14; ComponentLink8Description: https://datasheet.ciiva.com/7849/1018594-7849871.pdf?src-supplier=Element14
R23 = AC0402FR-07100KL: RES SMD 100K OHM 1% 1/16W 0402; Manufacturer: Yageo; Supplier: LCSC; Supplier Part Number: C144809; Manufacturer Part Number: AC0402FR-07100KL; ComponentLink1URL: https://datasheet.ciiva.com:443/pdfs/VipMasterIC/IC/YAGO/YAGO-S-A0003597364/YAGO-S-A0003597364-1.pdf?src-supplier=IHS+Markit; ComponentLink1Description: https://datasheet.ciiva.com:443/pdfs/VipMasterIC/IC/YAGO/YAGO-S-A0003597364/YAGO-S-A0003597364-1.pdf?src-supplier=IHS+Markit; ComponentLink2URL: https://www.yageo.com/upload/media/product/productsearch/datasheet/rchip/PYu-AC_51_RoHS_L_7.pdf?src-supplier=Digikey; ComponentLink2Description: https://www.yageo.com/upload/media/product/productsearch/datasheet/rchip/PYu-AC_51_RoHS_L_7.pdf?src-supplier=Digikey; ComponentLink3URL: https://datasheet.octopart.com/AC0402FR-07100KL-Yageo-datasheet-166720450.pdf?src-supplier=Future+Electronics; ComponentLink3Description: https://datasheet.octopart.com/AC0402FR-07100KL-Yageo-datasheet-166720450.pdf?src-supplier=Future+Electronics; ComponentLink4URL: http://www.yageo.com/NewPortal/yageodocoutput?fileName=/pdf/R-Chip/PYu-AC_51_RoHS_L_6.pdf&src-supplier=Digikey; ComponentLink4Description: http://www.yageo.com/NewPortal/yageodocoutput?fileName=/pdf/R-Chip/PYu-AC_51_RoHS_L_6.pdf&src-supplier=Digikey
SW1 SW2 = GT-TC089A-H043-L1: SMD Tactile Switches ROHS; Manufacturer: G-Switch; Manufacturer Part Number: GT-TC089A-H043-L1; Supplier: LCSC; Supplier Part Number: C843623
U1 = ESP32-S3-MINI-1-N8: SMD module, ESP32-S3FN8, 8 MB SPI flash, PCB antenna; Manufacturer: Espressif Systems; Supplier: LCSC; Supplier Part Number: C2913206; Manufacturer Part Number: ESP32-S3-MINI-1-N8; ComponentLink1URL: https://datasheet.octopart.com/ESP32-S3-MINI-1-N8-Espressif-Systems-datasheet-165560562.pdf?src-supplier=TME; ComponentLink1Description: https://datasheet.octopart.com/ESP32-S3-MINI-1-N8-Espressif-Systems-datasheet-165560562.pdf?src-supplier=TME
U2 = FT231XQ-R: IC USB SERIAL FULL UART 20QFN; Manufacturer: FTDI; Supplier: LCSC; Supplier Part Number: C132159; Manufacturer Part Number: FT231XQ-R; ComponentLink1URL: https://datasheet.ciiva.com:443/pdfs/VipMasterIC/IC/FTDI/FTDIS00099/FTDIS00099-1.pdf?src-supplier=IHS+Markit; ComponentLink1Description: https://datasheet.ciiva.com:443/pdfs/VipMasterIC/IC/FTDI/FTDIS00099/FTDIS00099-1.pdf?src-supplier=IHS+Markit; ComponentLink2URL: https://datasheet.ciiva.com/1787/ds-ft231x-1787312.pdf?src-supplier=Digikey; ComponentLink2Description: https://datasheet.ciiva.com/1787/ds-ft231x-1787312.pdf?src-supplier=Digikey; ComponentLink3URL: https://datasheet.ciiva.com/4787/ds-ft231x-13571-4787570.pdf?src-supplier=Mouser; ComponentLink3Description: https://datasheet.ciiva.com/4787/ds-ft231x-13571-4787570.pdf?src-supplier=Mouser; ComponentLink4URL: https://datasheet.ciiva.com/30475/0900766b811020d3-30475405.pdf?src-supplier=Rs; ComponentLink4Description: https://datasheet.ciiva.com/30475/0900766b811020d3-30475405.pdf?src-supplier=Rs; ComponentLink5URL: https://datasheet.ciiva.com/1787/ft-x-series-1787313.pdf?src-supplier=Digikey; ComponentLink5Description: https://datasheet.ciiva.com/1787/ft-x-series-1787313.pdf?src-supplier=Digikey; ComponentLink6URL: https://datasheet.ciiva.com/1787/ft-x-series-1787314.pdf?src-supplier=Digikey; ComponentLink6Description: https://datasheet.ciiva.com/1787/ft-x-series-1787314.pdf?src-supplier=Digikey
U3 = TPS62162DSGR: Buck Switching Regulator IC Positive Fixed 3.3V 1 Output 1A 8-WFDFN Exposed Pad; Manufacturer: Texas Instruments; Supplier: LCSC; Supplier Part Number: C40256; Manufacturer Part Number: TPS62162DSGR; ComponentLink1URL: https://datasheet.ciiva.com/2034/tps62161-2034675.pdf?src-supplier=Digikey; ComponentLink1Description: https://datasheet.ciiva.com/2034/tps62161-2034675.pdf?src-supplier=Digikey